# Altium project Line Detect Module.PrjPcb
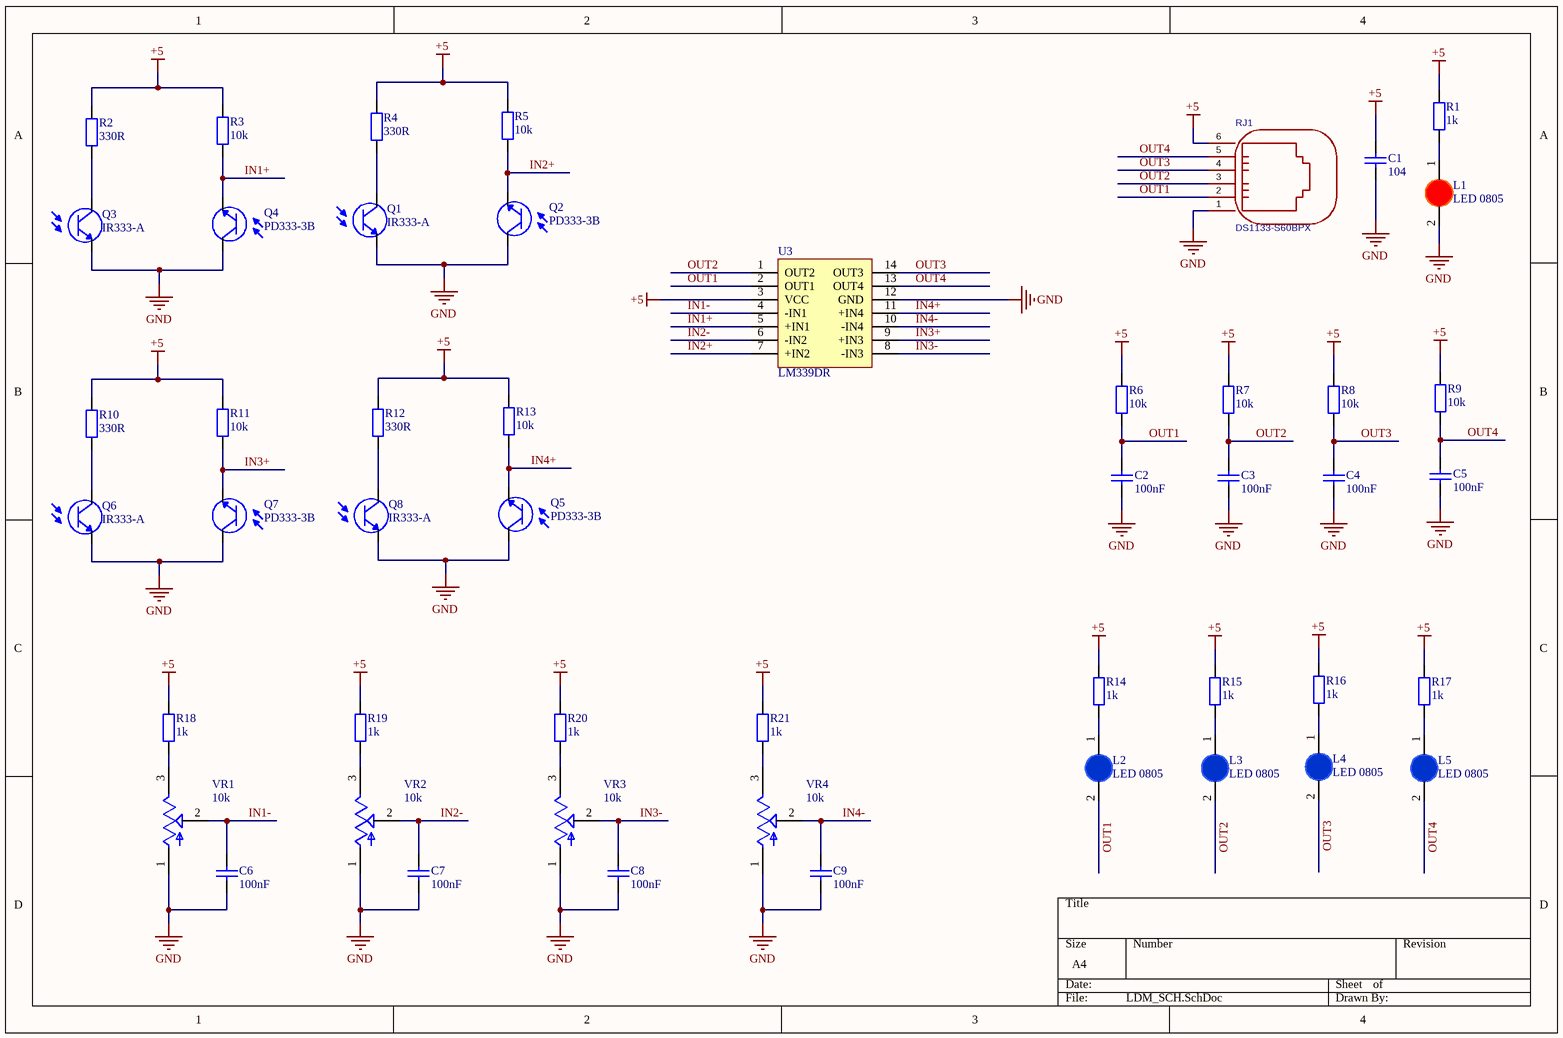
[diagram p0: LDM_SCH.SchDoc]
1 sheet, 49 parts. Net scope: global (net labels, ports and power ports of the same name join across sheets).
Board file: LDM_PCB.PcbDoc

## Sheet LDM_SCH.SchDoc
size A4; SheetNumber: 1; SheetTotal: 1

### Parts
C1  104  [tu 0603]
C2  100nF  [tu 0603]
C3  100nF  [tu 0603]
C4  100nF  [tu 0603]
C5  100nF  [tu 0603]
C6  100nF  [tu 0603]
C7  100nF  [tu 0603]
C8  100nF  [tu 0603]
C9  100nF  [tu 0603]
L1  LED 0805  [LED-0805-Red]
L2  LED 0805  [LED-0805-Blue]
L3  LED 0805  [LED-0805-Blue]
L4  LED 0805  [LED-0805-Blue]
L5  LED 0805  [LED-0805-Blue]
Q1  IR333-A  [IR333-A]
Q2  PD333-3B  [PD333-3B]
Q3  IR333-A  [IR333-A]
Q4  PD333-3B  [PD333-3B]
Q5  PD333-3B  [PD333-3B]
Q6  IR333-A  [IR333-A]
Q7  PD333-3B  [PD333-3B]
Q8  IR333-A  [IR333-A]
R1  1k  [tro smd 0603]
R2  330R  [tro smd 0603]
R3  10k  [tro smd 0603]
R4  330R  [tro smd 0603]
R5  10k  [tro smd 0603]
R6  10k  [tro smd 0603]
R7  10k  [tro smd 0603]
R8  10k  [tro smd 0603]
R9  10k  [tro smd 0603]
R10  330R  [tro smd 0603]
R11  10k  [tro smd 0603]
R12  330R  [tro smd 0603]
R13  10k  [tro smd 0603]
R14  1k  [tro smd 0603]
R15  1k  [tro smd 0603]
R16  1k  [tro smd 0603]
R17  1k  [tro smd 0603]
R18  1k  [tro smd 0603]
R19  1k  [tro smd 0603]
R20  1k  [tro smd 0603]
R21  1k  [tro smd 0603]
RJ1  DS1133-S60BPX  [RJ11-TH_DS1133-S60BPX]
U3  LM339DR  [TSSOP14_25.6_296_15X55_SMD]
VR1  10k  [TRIM_3362P-1-102]
VR2  10k  [TRIM_3362P-1-102]
VR3  10k  [TRIM_3362P-1-102]
VR4  10k  [TRIM_3362P-1-102]

### Nets
+5: C1.1 R1.2 R2.2 R3.2 R4.2 R5.2 R6.2 R7.2 R8.2 R9.2 R10.2 R11.2 R12.2 R13.2 R14.2 R15.2 R16.2 R17.2 R18.2 R19.2 R20.2 R21.2 RJ1.6 U3.3(VCC)
GND: C1.2 C2.2 C3.2 C4.2 C5.2 C6.2 C7.2 C8.2 C9.2 L1.2(K) Q1.E Q2.C Q3.E Q4.C Q5.C Q6.E Q7.C Q8.E RJ1.1 U3.12(GND) VR1.1(CCW) VR2.1(CCW) VR3.1(CCW) VR4.1(CCW)
IN1+: Q4.E R3.1 U3.5(+IN1)
IN1-: C6.1 U3.4(-IN1) VR1.2(WIPER)
IN2+: Q2.E R5.1 U3.7(+IN2)
IN2-: C7.1 U3.6(-IN2) VR2.2(WIPER)
IN3+: Q7.E R11.1 U3.9(+IN3)
IN3-: C8.1 U3.8(-IN3) VR3.2(WIPER)
IN4+: Q5.E R13.1 U3.11(+IN4)
IN4-: C9.1 U3.10(-IN4) VR4.2(WIPER)
OUT1: C2.1 L2.2(K) R6.1 RJ1.2 U3.2(OUT1)
OUT2: C3.1 L3.2(K) R7.1 RJ1.3 U3.1(OUT2)
OUT3: C4.1 L4.2(K) R8.1 RJ1.4 U3.14(OUT3)
OUT4: C5.1 L5.2(K) R9.1 RJ1.5 U3.13(OUT4)
NetL1_1: L1.1(A) R1.1
NetL2_1: L2.1(A) R14.1
NetL3_1: L3.1(A) R15.1
NetL4_1: L4.1(A) R16.1
NetL5_1: L5.1(A) R17.1
NetQ1_C: Q1.C R4.1
NetQ3_C: Q3.C R2.1
NetQ6_C: Q6.C R10.1
NetQ8_C: Q8.C R12.1
NetR18_1: R18.1 VR1.3(CW)
NetR19_1: R19.1 VR2.3(CW)
NetR20_1: R20.1 VR3.3(CW)
NetR21_1: R21.1 VR4.3(CW)

### Library data of the parts
C1-C9 = Tu 0603 104 50V 10%: Dán; Don_Vi: Con; So_Chan: 2; Ten_Linh_Kien: Tụ 0603 104-100nF 10% 50V; Ma_Hang: MH004568; Chung_Loai: Dán; Kieu_Chan: *
L1 = LED 0805 Do: Dán; Don_Vi: Con; Ma_Hang: MH000897; Ten_Linh_Kien: LED 0805 Màu Đỏ (Red); Ghi_Chu: *; Kieu_Chan: *; Chung_Loai: Dán
L2-L5 = LED 0805 Xanh Duong: Dán; Don_Vi: Con; Ma_Hang: MH002327; Ten_Linh_Kien: LED 0805 Màu Xanh Dương (Blue); Ghi_Chu: *; Kieu_Chan: *; Chung_Loai: Dán
Q1 Q3 Q6 Q8 = IR333-A: MP: BPW16N; Package: None; Price: None; Value: *; Availability: Unavailable
Q2 Q4 Q5 Q7 = PD333-3B: MP: BPW16N; Package: None; Price: None; Value: *; Availability: Unavailable
R1 R6-R9 R14-R17 = Tro 0603 1% 1k: Dán; So_Chan: 2; Don_Vi: Con; Ten_Linh_Kien: Trở 0603 1% 1k; Ma_Hang: MH006334; Chung_Loai: Dán; Kieu_Chan: *
R2 R4 R10 R12 = Tro 0603 5% 330R: Dán; Don_Vi: Con; Ma_Hang: MH006910; So_Chan: 2; Ten_Linh_Kien: Trở 0603 5% 330R; Chung_Loai: Dán; Kieu_Chan: *
R3 R5 R11 R13 R18-R21 = Tro 0603 1% 10k: Dán; Don_Vi: Con; So_Chan: 2; Ten_Linh_Kien: Trở 0603 1% 10k; Ma_Hang: MH006333; Chung_Loai: Dán; Kieu_Chan: *
RJ1 = DS1133-S60BPX: Connector Type:RJ12 Jack Mounting Type:Right Angle Number of Ports:1 LED:Non-LED Shielding:Unshielded Ratings:- PoE:Non-PoE Supplementary Features:Harpoon Contact (Plastic) Contact Material:Copper alloy Contact Plating:Gold Operating Temperature:-40℃~+85℃; Manufacturer: CONNFLY; AddInBom: yes; ModelId: 233decdc871549d2a39df488d254df7dÂŽ0819f05c4eef4c71ace90d822a990e87; ModelTransform: 511.81,574.316,0,0,0,0,-120.079,0.551,-125.984; Number of Ports: 1; Symbol: DS1133-S60BPX; Device: DS1133-S60BPX; LCSC Part Name: 弯插 不带LED; SupplierPart: C77859; ManufacturerPart: DS1133-S60BPX; Supplier Footprint: 插件; JLCPCB Part Class: Extended Part; Datasheet: https://item.szlcsc.com/datasheet/DS1133-S60BPX/78993.html; Supplier: LCSC; ConvertToPcb: yes; FootprintName: RJ11-TH_DS1133-S60BPX; ModelName: RJ11-TH_DS1133-S60BPX; Connector Type: RJ12 Jack; Mounting Type: Right Angle; LED: Non-LED; Shielding: Unshielded; Ratings: -; PoE: Non-PoE; Supplementary Features: Harpoon Contact (Plastic); Contact Material: Copper alloy; Contact Plating: Gold; Operating Temperature: -40℃~+85℃
U3 = IC_LM339DR: Comparator Differential CMOS, MOS, Open-Collector, TTL 14-SOIC; Manufacturer: TI National Semiconductor; Alternate Part Number-1: LM339NSR; Manufacturer Part Number: LM339DR; Case/Package: TSSOP14; Supplier-1: LCSC; Supplier Part Number-1: C7948
VR1-VR4 = Bien tro vuong: TRIMMER - 1/4in SQ ST CERMET | Bourns 3362P-1-102; SnapEDA_Link: https://www.snapeda.com/parts/3362P-1-102/Bourns/view-part/?ref=snap; Package: 3362P-1 Bourns Inc.; Value: *; MF: Bourns; MP: 3362P-1-102; Check_prices: https://www.snapeda.com/parts/3362P-1-102/Bourns/view-part/?ref=eda